# EasyEDA schematic schematic.json
TITLE: Sheet_1; REV: 1.0; Date: 2025-01-04; Sheet: 1/1; Drawn By: sayhan1610; Company: Your Company
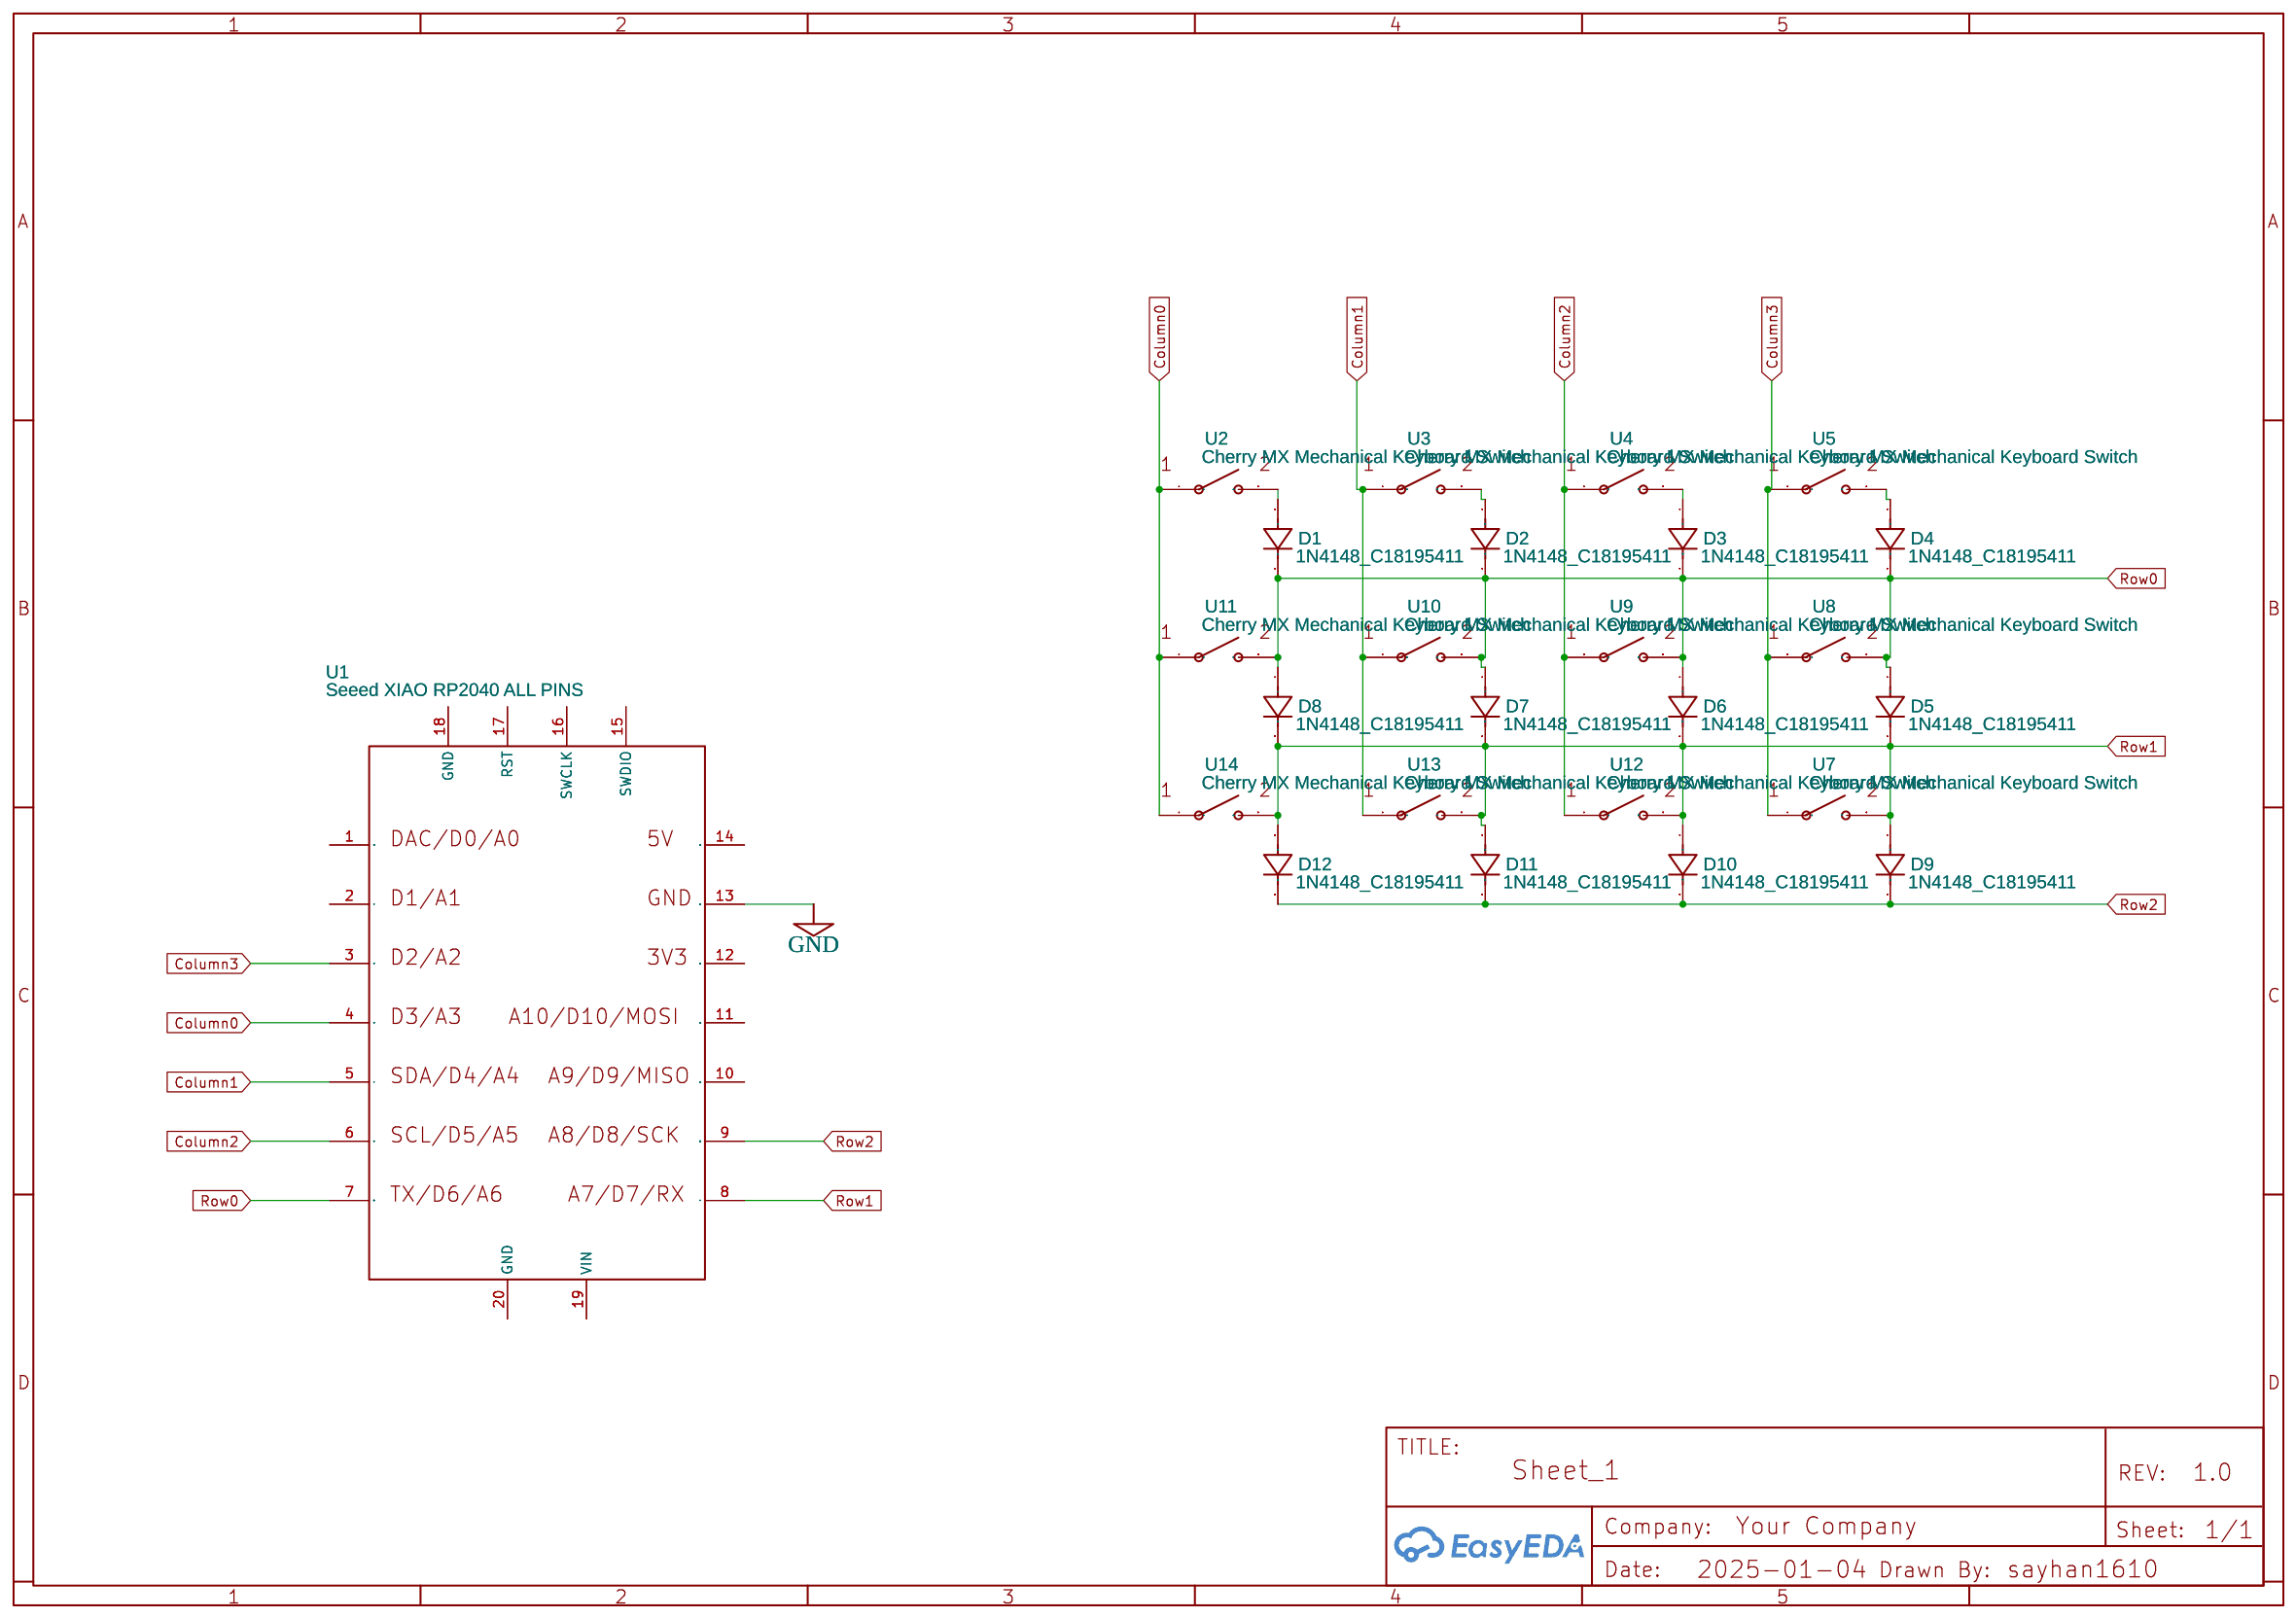
[diagram p0: schematic sheet]

## Parts
D1  1N4148_C18195411  [DO-35_BD2.2-L4.0-D0.50_1N4148]
D2  1N4148_C18195411  [DO-35_BD2.2-L4.0-D0.50_1N4148]
D3  1N4148_C18195411  [DO-35_BD2.2-L4.0-D0.50_1N4148]
D4  1N4148_C18195411  [DO-35_BD2.2-L4.0-D0.50_1N4148]
D5  1N4148_C18195411  [DO-35_BD2.2-L4.0-D0.50_1N4148]
D6  1N4148_C18195411  [DO-35_BD2.2-L4.0-D0.50_1N4148]
D7  1N4148_C18195411  [DO-35_BD2.2-L4.0-D0.50_1N4148]
D8  1N4148_C18195411  [DO-35_BD2.2-L4.0-D0.50_1N4148]
D9  1N4148_C18195411  [DO-35_BD2.2-L4.0-D0.50_1N4148]
D10  1N4148_C18195411  [DO-35_BD2.2-L4.0-D0.50_1N4148]
D11  1N4148_C18195411  [DO-35_BD2.2-L4.0-D0.50_1N4148]
D12  1N4148_C18195411  [DO-35_BD2.2-L4.0-D0.50_1N4148]
U1  Seeed XIAO RP2040 ALL PINS  [SEEED XIAO RP2040]
U2  Cherry MX Mechanical Keyboard Switch  [CHERRY MX KEYSWITCH]
U3  Cherry MX Mechanical Keyboard Switch  [CHERRY MX KEYSWITCH]
U4  Cherry MX Mechanical Keyboard Switch  [CHERRY MX KEYSWITCH]
U5  Cherry MX Mechanical Keyboard Switch  [CHERRY MX KEYSWITCH]
U7  Cherry MX Mechanical Keyboard Switch  [CHERRY MX KEYSWITCH]
U8  Cherry MX Mechanical Keyboard Switch  [CHERRY MX KEYSWITCH]
U9  Cherry MX Mechanical Keyboard Switch  [CHERRY MX KEYSWITCH]
U10  Cherry MX Mechanical Keyboard Switch  [CHERRY MX KEYSWITCH]
U11  Cherry MX Mechanical Keyboard Switch  [CHERRY MX KEYSWITCH]
U12  Cherry MX Mechanical Keyboard Switch  [CHERRY MX KEYSWITCH]
U13  Cherry MX Mechanical Keyboard Switch  [CHERRY MX KEYSWITCH]
U14  Cherry MX Mechanical Keyboard Switch  [CHERRY MX KEYSWITCH]

## Library data of the parts
D1-D12 = 1N4148_C18195411: Supplier: LCSC; Supplier Part: C18195411; Manufacturer: LJ(朗捷); Manufacturer Part: 1N4148; JLCPCB Part Class: Extended Part; Contributor: lcsc
U1 = Seeed XIAO RP2040 ALL PINS: Manufacturer: Seeedstudio; Manufacturer Part: 102010328; link: https://www.seeedstudio.com/Seeeduino-XIAO-Arduino-Microcontroller-SAMD21-Cortex-M0+-p-4426.html; Contributor: Derick2k
U2-U5 U7-U14 = Cherry MX Mechanical Keyboard Switch: Contributor: Enkhbold Ganbold

## Nets
GND: U1.13(12)
Column0: U1.4(3) U2.1 U11.1 U14.1
Column1: U1.5(4) U3.1 U10.1 U13.1
Column2: U1.6(5) U4.1 U9.1 U12.1
Column3: U1.3(2) U5.1 U7.1 U8.1
Row0: D1.2(C) D2.2(C) D3.2(C) D4.2(C) D5.1(A) D6.1(A) D7.1(A) D8.1(A) U1.7(6) U8.2 U9.2 U10.2 U11.2
Row1: D5.2(C) D6.2(C) D7.2(C) D8.2(C) D9.1(A) D10.1(A) D11.1(A) D12.1(A) U1.8(7) U7.2 U12.2 U13.2 U14.2
Row2: D9.2(C) D10.2(C) D11.2(C) D12.2(C) U1.9(8)
Net-(D1-1): D1.1(A) U2.2
Net-(D2-1): D2.1(A) U3.2
Net-(D3-1): D3.1(A) U4.2
Net-(D4-1): D4.1(A) U5.2

Not connected (* = marked no-connect by the designer): U1 1(0) 2(1) 10(9) 11(10) 12(11) 14(13) 15(SWDIO) 16(SWCLK) 17(RST) 18(GND) 19(VIN) 20(GND)
